# EAGLE design OSC_V1 (EAGLE 9.5.0)
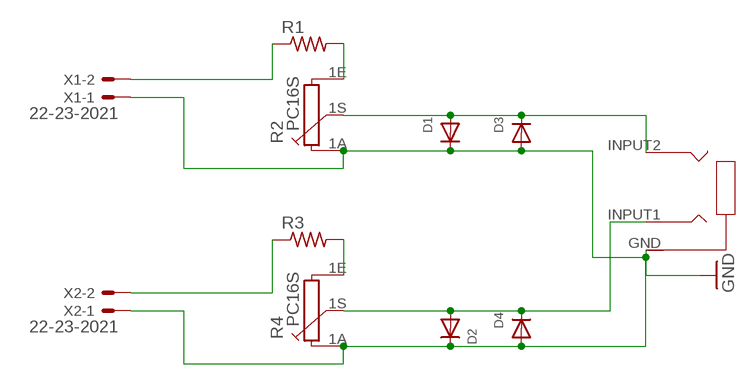
[diagram p0: schematic, sheet 1]

## Parts
D1  DIODEDO-1N4148  [DO-1N4148]
D2  DIODEDO-1N4148  [DO-1N4148]
D3  DIODEDO-1N4148  [DO-1N4148]
D4  DIODEDO-1N4148  [DO-1N4148]
R1  R-US_0204/7  [0204/7]
R2  PC16S  [PC16S]
R3  R-US_0204/7  [0204/7]
R4  PC16S  [PC16S]
U$1  AUDIO3PIN  [AUDIO3PIN]
X1  22-23-2021  [22-23-2021]
X2  22-23-2021  [22-23-2021]

## Nets
GND: D1.C D2.C D3.A D4.A R2.1A R4.1A U$1.GND X1.1 X2.1
N$1: R1.1 X1.2
N$2: R1.2 R2.1E
N$4: D1.A D3.C R2.1S U$1.INPUT2
N$5: R3.1 X2.2
N$6: R3.2 R4.1E
N$8: D2.A D4.C R4.1S U$1.INPUT1

## Library data of the parts
D1-D4 = adafruit:DIODE: Diode SMADIODE - SMA Surface Mount Package 20V 1A Schottky Diode Digikey: 641-1014-6-ND DO-1N4148 - Through Hole Small Current Diode SOD-123 20V 1 A (.5mV Vf) Schottky Diode - Digikey: MBRX120TPMSCT-ND SOD-323 10V 570mA (.38mV Vf, 3ns) Schottky Diode - Digikey: ZLLS410CT-ND SOD-523 30V 30mA Schottky Diode (RB751S-40TE61) - Digikey: RB751S-40TE61CT-ND SOT23-R/W - SOT23 Package (R = Solder Paste/Reflow Ovens, W = Hand-Soldering) BAT54Film 40V 300mA - Digikey: 497-7162-1-ND; MPN: 1N4148 (DO-35); OC_NEWARK: unknown
R1 R3 = adafruit:R-US_: RESISTOR, American symbol; OC_NEWARK: unknown
R2 R4 = piher:PC16S: POTENTIOMETER single carbon potentiometer, 16 mm, S3ROH; MPN: P160KN-0QC15B500K; OC_FARNELL: 4452940; OC_NEWARK: 14R5474
U$1 = Test:AUDIO3PIN
X1 X2 = con-molex:22-23-2021: .100" (2.54mm) Center Header - 2 Pin; MF: MOLEX; MPN: 22-23-2021; OC_FARNELL: 1462926; OC_NEWARK: unknown

## Board
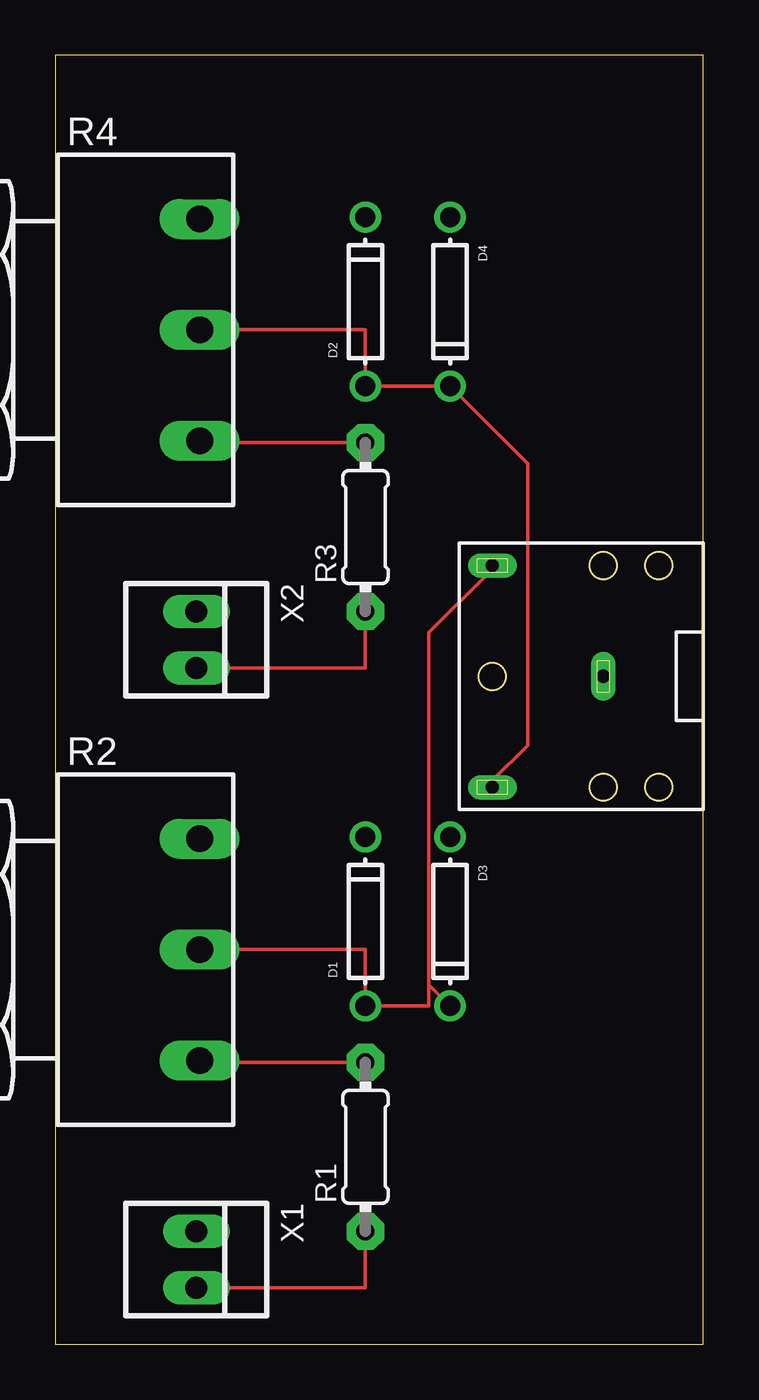
[diagram p1: board, top side]
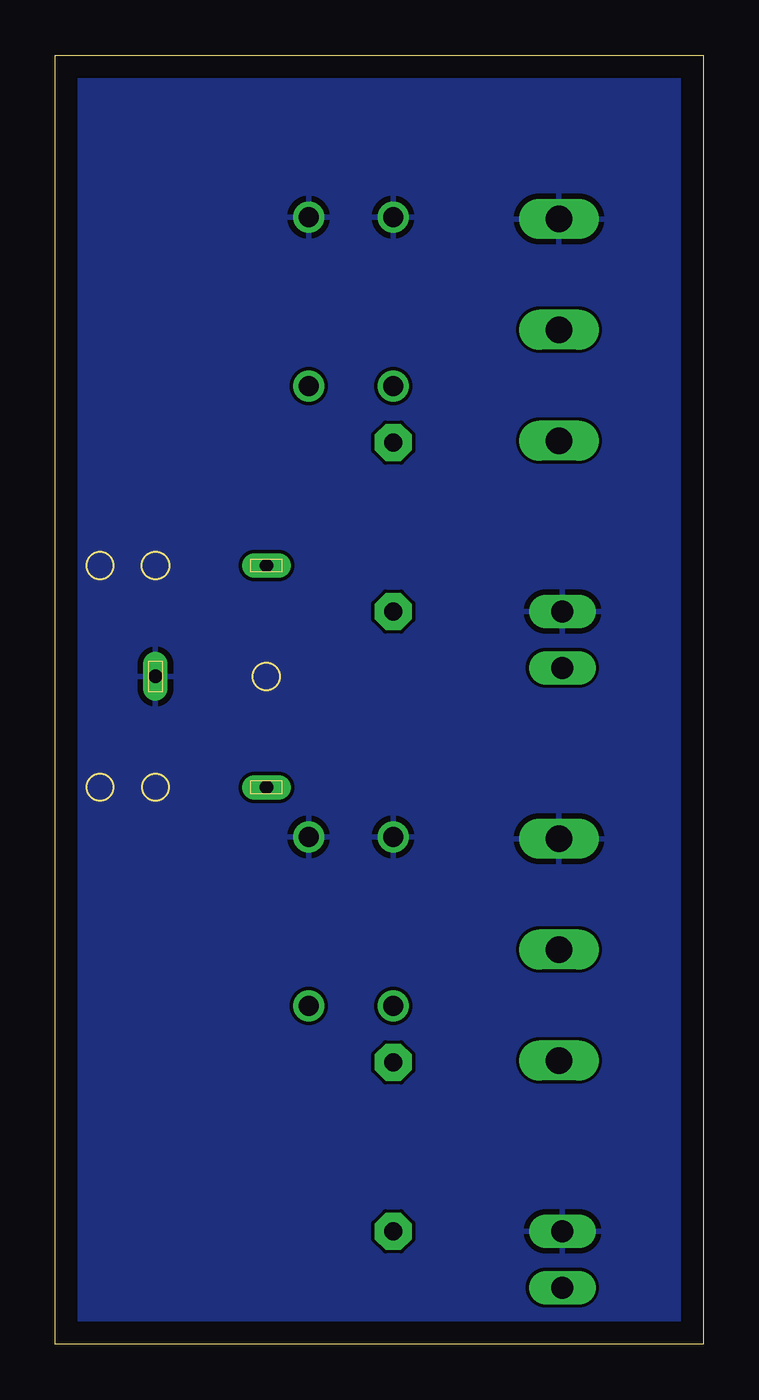
[diagram p2: board, bottom side, seen from below]

Size 29.19 x 58.09 mm. Coordinates in mm from the lower left corner, seen from the top.
Outline: 0,0 29.19,0 29.19,58.09 0,58.09 0,0
Copper layers (1*16): Top 0.035mm / dielectric 1.5mm / Bottom 0.035mm
Design rules "default": minimum track width 6mil, minimum drill 0.35mm, track to track 6mil, track to pad 6mil, pad to pad 6mil, via to via 6mil, smd to smd 6mil, copper to edge 40mil, drill to drill 6mil, minimum pad ring 10mil, minimum via ring 8mil, stop-mask expansion 4mil, vias tented up to drill 0mil, thermal gap 10mil

### Footprints (pad centres in the part's own frame; a part is rotated, then mirrored left to right if it is on the bottom)
DO-1N4148 = drill 0.9: A -3.81,0; C 3.81,0
0204/7 = drill 0.813 pad 1.676 octagon: 1 -3.81,0; 2 3.81,0
PC16S = drill 1.2 long: 1A -5,6.5; 1E 5,6.5; 1S 0,6.5
AUDIO3PIN = drill 0.6 long: GND -5,0; INPUT1 0,5; INPUT2 0,-5
22-23-2021 = drill 1 long: 1 -1.27,0; 2 1.27,0

### Placement (x,y rotation side)
D1  13.97,19.05 90 top
D2  13.97,46.99 90 top
D3  17.78,19.05 270 top
D4  17.78,46.99 270 top
R1  13.97,8.89 90 top
R2  0,17.78 270 top
R3  13.97,36.83 90 top
R4  0,45.72 270 top
U$1  19.68,30.1 180 top
X1  6.35,3.81 270 top
X2  6.35,31.75 270 top

### Tracks (layer width: path | path; a pad name or v marks a point on that pad's centre or on a via)
GND
  pour Bottom: -6.35,62.23 -6.35,-5.08 34.29,-5.08 34.29,63.5 33.02,63.5 -6.35,63.5
N$1
  Top 0.152: X1.2 13.97,2.54 R1.1
N$2
  Top 0.152: R1.2 6.67,12.7 R2.1E
N$4
  Top 0.152: 16.83,16.19 16.83,32.07 19.68,34.92 U$1.INPUT2 | D3.C 16.83,16.19 | 16.83,16.19 16.83,15.24 D1.A 13.97,17.78 R2.1S
N$5
  Top 0.152: X2.2 13.97,30.48 R3.1
N$6
  Top 0.152: R3.2 6.67,40.64 R4.1E
N$8
  Top 0.152: U$1.INPUT1 19.68,25.4 21.27,26.99 21.27,39.69 D4.C D2.A 13.97,45.72 R4.1S